# Altium schematic sheet 1-MAIN.SchDoc: MAIN
size A0; Author: Alexandre Cosneau; CompanyName: Tristar Multicopters; DrawnBy: Alexandre Cosneau; Engineer: Alexandre Cosneau; Organization: Tristar Multicopters; Address1: Genie / GEGI; Address2: 2500 boulevard de l'universite; Address3: J1K2R SHERBROOKE; Address4: QUEBEC, CANADA; DocumentNumber: 2; Revision: 1.0; SheetNumber: 2; SheetTotal: 15
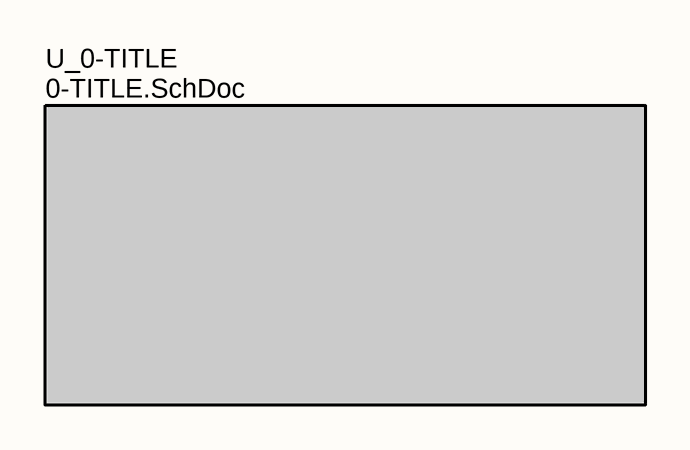
[diagram p0: 1-MAIN.SchDoc]

## Sub-sheets
U_0-TITLE = 0-TITLE.SchDoc: no entries

## Notes on the sheet
- Title
- Size:
- Date:
- File:
- A0
- Number:
- Time:
- Revision:
- Sheet
- of